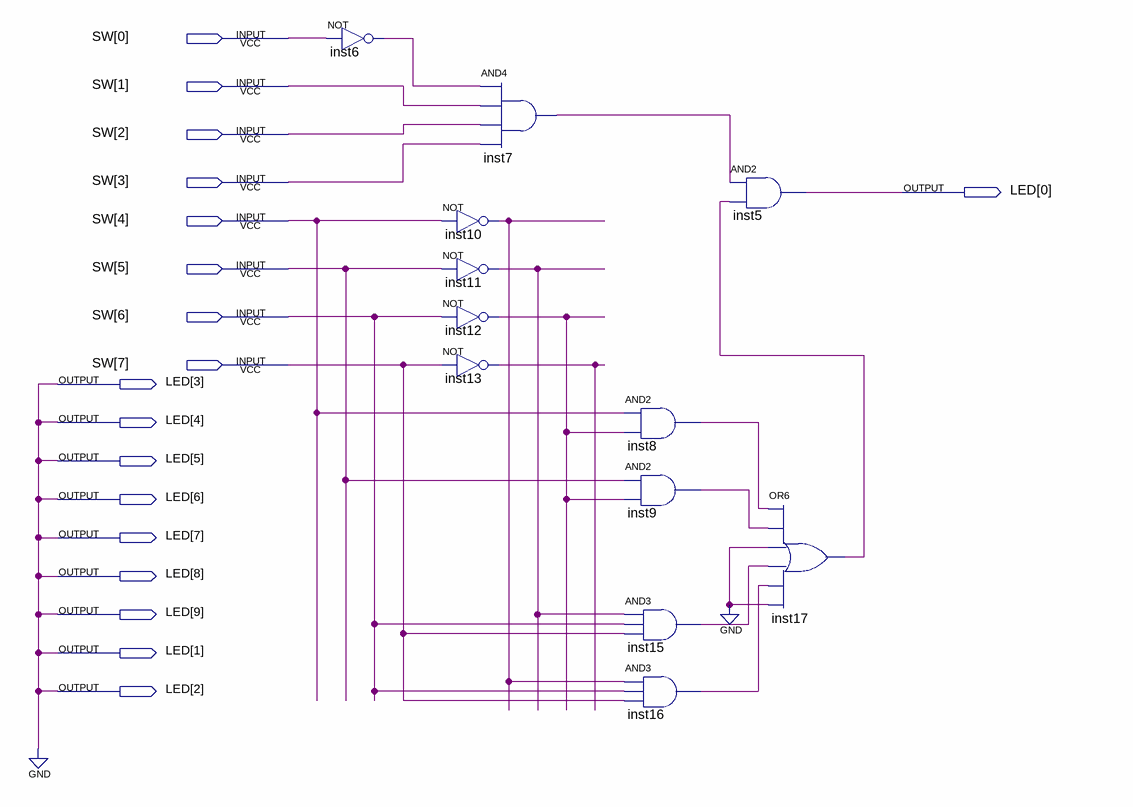
[diagram p0: schematic sheet]
// Quartus schematic rlab_02.bdf as structural Verilog: 12 symbols, 18 pins
module rlab_02 (
  input  [7:0] SW,
  output [9:0] LED
);

  wire inst6_out, inst7_out, inst8_out, inst9_out, inst10_out, inst11_out, inst12_out, inst13_out,
       inst15_out, inst16_out, inst17_out;

  not inst6 (inst6_out, SW[0]);
  not inst10 (inst10_out, SW[4]);
  not inst11 (inst11_out, SW[5]);
  not inst12 (inst12_out, SW[6]);
  not inst13 (inst13_out, SW[7]);
  and inst7 (inst7_out, inst6_out, SW[1], SW[2], SW[3]);
  and inst8 (inst8_out, SW[4], inst12_out);
  and inst9 (inst9_out, SW[5], inst12_out);
  and inst15 (inst15_out, inst11_out, SW[6], SW[7]);
  and inst16 (inst16_out, inst10_out, SW[6], SW[7]);
  and inst5 (LED[0], inst7_out, inst17_out);
  or inst17 (inst17_out, inst8_out, inst9_out, 1'b0, inst15_out, inst16_out, 1'b0);

  assign LED[9:1] = {9{1'b0}};
endmodule
